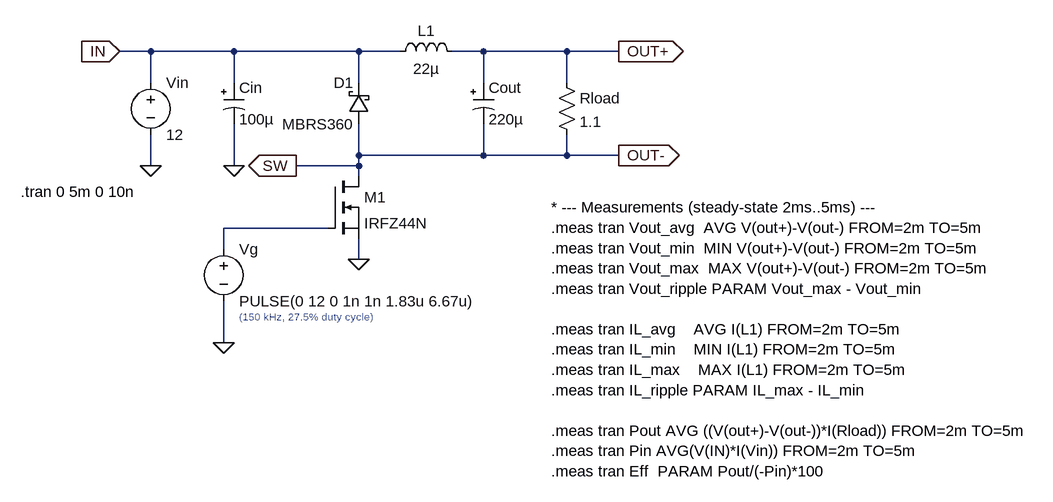
[diagram p0: schematic AsyncBuck_12V_to_3.3V_3A.asc]
AsyncBuck_12V_to_3.3V_3A.asc, the LTspice schematic file:
Version 4
SHEET 1 1060 680
WIRE -368 -64 -416 -64
WIRE -240 -64 -368 -64
WIRE -48 -64 -240 -64
WIRE 16 -64 -48 -64
WIRE 144 -64 96 -64
WIRE 272 -64 144 -64
WIRE 352 -64 272 -64
WIRE -368 -16 -368 -64
WIRE -240 -16 -240 -64
WIRE -48 -16 -48 -64
WIRE 144 -16 144 -64
WIRE 272 -16 272 -64
WIRE -48 96 -48 48
WIRE 144 96 144 48
WIRE 144 96 -48 96
WIRE 272 96 272 64
WIRE 272 96 144 96
WIRE 352 96 272 96
WIRE -368 112 -368 64
WIRE -240 112 -240 48
WIRE -48 112 -48 96
WIRE -48 112 -144 112
WIRE -48 128 -48 112
WIRE -96 208 -256 208
WIRE -256 240 -256 208
WIRE -48 256 -48 224
WIRE -256 384 -256 320
FLAG -368 112 0
FLAG -240 112 0
FLAG -48 256 0
FLAG -256 384 0
FLAG -416 -64 IN
IOPIN -416 -64 In
FLAG 352 -64 OUT+
IOPIN 352 -64 Out
FLAG -144 112 SW
IOPIN -144 112 Out
FLAG 352 96 OUT-
IOPIN 352 96 Out
SYMBOL voltage -368 -32 R0
WINDOW 123 0 0 Left 0
WINDOW 39 0 0 Left 0
SYMATTR InstName Vin
SYMATTR Value 12
SYMBOL voltage -256 224 R0
WINDOW 123 0 0 Left 0
WINDOW 39 0 0 Left 0
SYMATTR InstName Vg
SYMATTR Value PULSE(0 12 0 1n 1n 1.83u 6.67u)
SYMBOL nmos -96 128 R0
SYMATTR InstName M1
SYMATTR Value IRFZ44N
SYMBOL schottky -32 48 R180
WINDOW 0 24 64 Left 2
WINDOW 3 24 0 Left 2
SYMATTR InstName D1
SYMATTR Value MBRS360
SYMATTR Description Diode
SYMATTR Type diode
SYMBOL ind 0 -48 R270
WINDOW 0 32 56 VTop 2
WINDOW 3 5 56 VBottom 2
SYMATTR InstName L1
SYMATTR Value 22µ
SYMATTR SpiceLine Ipk=4.96 Rser=0.0407 Rpar=19022.6 Cpar=0 mfg="Coilcraft" pn="MSS1260-223"
SYMBOL polcap -256 -16 R0
WINDOW 3 24 56 Left 2
SYMATTR Value 100µ
SYMATTR InstName Cin
SYMATTR Description Capacitor
SYMATTR Type cap
SYMATTR SpiceLine V=25 Irms=116m Rser=0.169 Lser=5.162n mfg="Würth Elektronik" pn="865230453006 WCAP-AS5H 8x10,5" type="Al electrolytic"
SYMBOL polcap 128 -16 R0
WINDOW 3 24 56 Left 2
SYMATTR Value 220µ
SYMATTR InstName Cout
SYMATTR Description Capacitor
SYMATTR Type cap
SYMATTR SpiceLine V=6.3 Irms=3.87298 Rser=0.015 Lser=0 mfg="KEMET" pn="A700X227M006ATE015" type="Al electrolytic"
SYMBOL res 256 -32 R0
SYMATTR InstName Rload
SYMATTR Value 1.1
TEXT -232 344 Left 1 ;(150 kHz, 27.5% duty cycle)
TEXT -568 152 Left 2 !.tran 0 5m 0 10n
TEXT 248 176 Left 2 !* --- Measurements (steady-state 2ms..5ms) ---\n.meas tran Vout_avg  AVG V(out+)-V(out-) FROM=2m TO=5m\n.meas tran Vout_min  MIN V(out+)-V(out-) FROM=2m TO=5m\n.meas tran Vout_max  MAX V(out+)-V(out-) FROM=2m TO=5m\n.meas tran Vout_ripple PARAM Vout_max - Vout_min\n \n.meas tran IL_avg    AVG I(L1) FROM=2m TO=5m\n.meas tran IL_min    MIN I(L1) FROM=2m TO=5m\n.meas tran IL_max    MAX I(L1) FROM=2m TO=5m\n.meas tran IL_ripple PARAM IL_max - IL_min\n \n.meas tran Pout AVG ((V(out+)-V(out-))*I(Rload)) FROM=2m TO=5m\n.meas tran Pin AVG(V(IN)*I(Vin)) FROM=2m TO=5m\n.meas tran Eff  PARAM Pout/(-Pin)*100

The netlist it stands for:
* AsyncBuck_12V_to_3.3V_3A.asc
Vin IN 0 12
Vg N001 0 PULSE(0 12 0 1n 1n 1.83u 6.67u)
M1 OUT- N001 0 0 IRFZ44N
D1 OUT- IN MBRS360
L1 IN OUT+ 22µ Ipk=4.96 Rser=0.0407 Rpar=19022.6 Cpar=0 mfg="Coilcraft" pn="MSS1260-223"
Cin IN 0 100µ V=25 Irms=116m Rser=0.169 Lser=5.162n mfg="Würth Elektronik" pn="865230453006 WCAP-AS5H 8x10,5" type="Al electrolytic"
Cout OUT+ OUT- 220µ V=6.3 Irms=3.87298 Rser=0.015 Lser=0 mfg="KEMET" pn="A700X227M006ATE015" type="Al electrolytic"
Rload OUT+ OUT- 1.1
.model D D
.lib standard.dio
.model NMOS NMOS
.model PMOS PMOS
.lib standard.mos
* (150 kHz, 27.5% duty cycle)
.tran 0 5m 0 10n
* --- Measurements (steady-state 2ms..5ms) ---
.meas tran Vout_avg  AVG V(out+)-V(out-) FROM=2m TO=5m
.meas tran Vout_min  MIN V(out+)-V(out-) FROM=2m TO=5m
.meas tran Vout_max  MAX V(out+)-V(out-) FROM=2m TO=5m
.meas tran Vout_ripple PARAM Vout_max - Vout_min
.meas tran IL_avg    AVG I(L1) FROM=2m TO=5m
.meas tran IL_min    MIN I(L1) FROM=2m TO=5m
.meas tran IL_max    MAX I(L1) FROM=2m TO=5m
.meas tran IL_ripple PARAM IL_max - IL_min
.meas tran Pout AVG ((V(out+)-V(out-))*I(Rload)) FROM=2m TO=5m
.meas tran Pin AVG(V(IN)*I(Vin)) FROM=2m TO=5m
.meas tran Eff  PARAM Pout/(-Pin)*100
.backanno
.end